# Altium schematic sheet Aux PSU.SchDoc
size A4; SheetNumber: 9; SheetTotal: 12
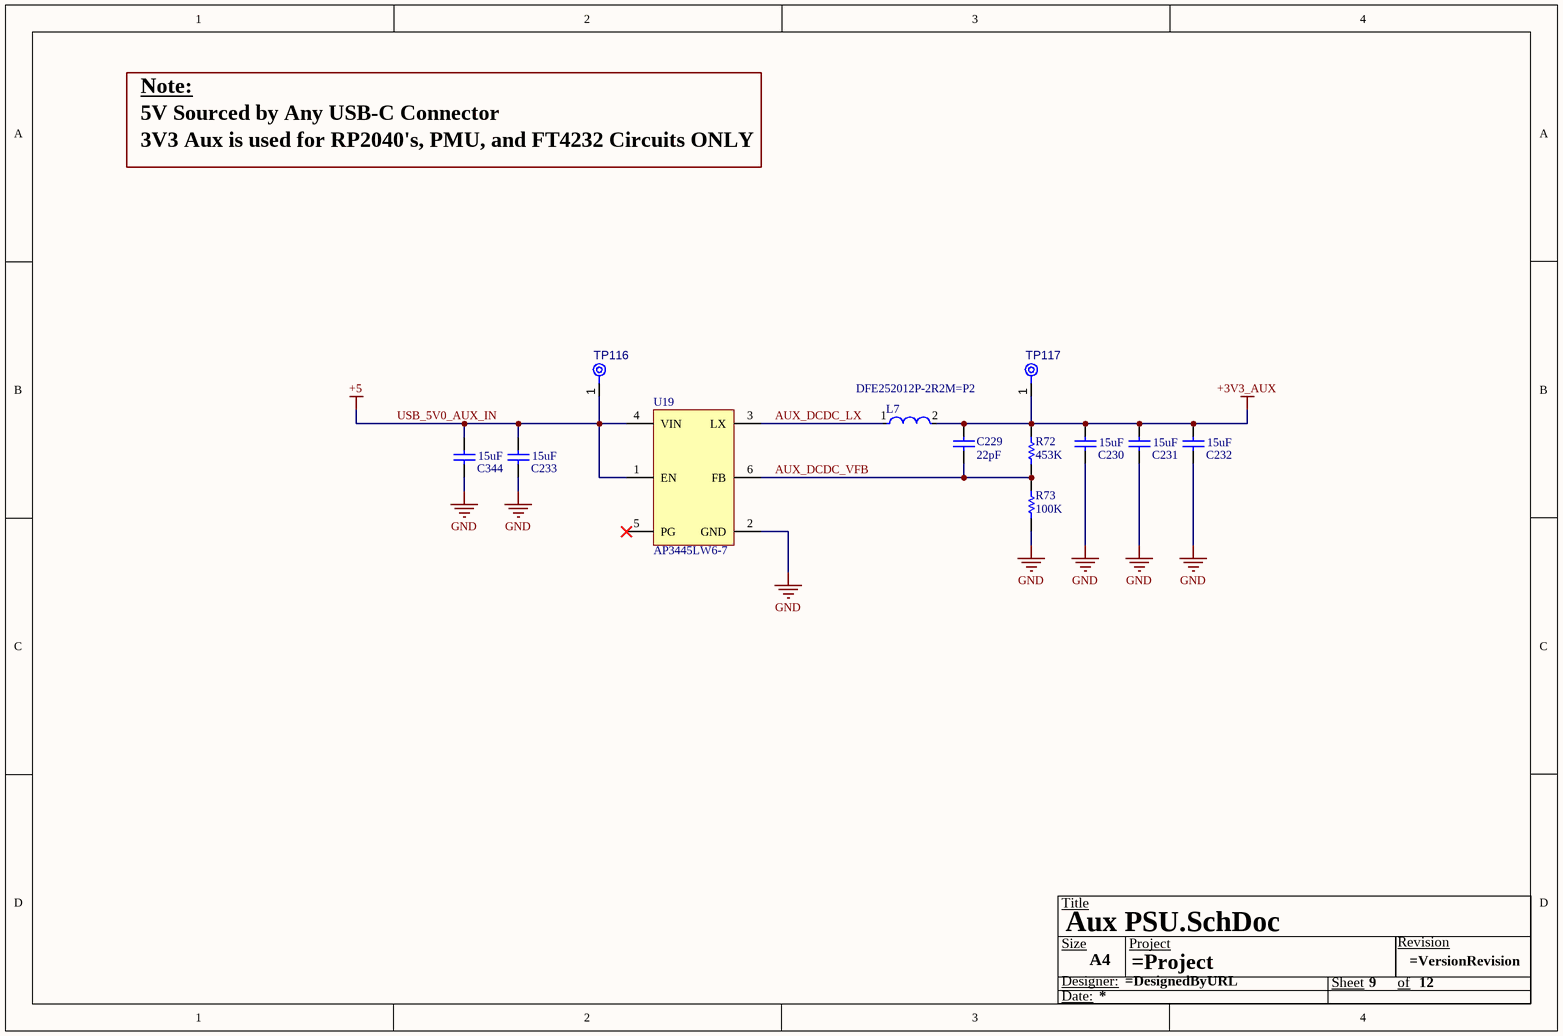
[diagram p0: Aux PSU.SchDoc]

## Parts
*  Size: A4  (hidden comment: Title Block)  (graphical)
C229  22pF  [CAPC1005X55X25ML05T05]
C230  15uF  [CAPC0805(2012)145_L]
C231  15uF  [CAPC0805(2012)145_L]
C232  15uF  [CAPC0805(2012)145_L]
C233  15uF  [CAPC0805(2012)145_L]
C344  15uF  [CAPC0805(2012)145_L]
L7  DFE252012P-2R2M=P2  [FP-DFE252012C-MFG]
R72  453K  [RESC1005X40X25NL05T10]
R73  100K  [RESC1005X40X25NL05T10]
TP116  TPAD6R  [TP06R]  (value not drawn)  (no BOM)
TP117  TPAD6R  [TP06R]  (value not drawn)  (no BOM)
U19  AP3445LW6-7  [SOT95P245X130-6N]

## Nets
+3V3_AUX: C229.2 C230.2 C231.2 C232.2 L7.2 R72.2 TP117.1(TP)
GND: C230.1 C231.1 C232.1 C233.1 C344.1 R73.1 U19.2(GND)
USB_5V0_AUX_IN: C233.2 C344.2 TP116.1(TP) U19.1(EN) U19.4(VIN)  [also labelled +5]
AUX_DCDC_LX: L7.1 U19.3(LX)
AUX_DCDC_VFB: C229.1 R72.1 R73.2 U19.6(FB)

Not connected (* = marked no-connect by the designer): U19 5(PG)*

## Notes on the sheet
- Note:
- 5V Sourced by Any USB-C Connector
- 3V3 Aux is used for RP2040's, PMU, and FT4232 Circuits ONLY
- (in symbol CMP-007-000006-8) Title; Size; Project; Revision; Designer:; Sheet; of; Date:

## Library data of the parts
* = CMP-007-000006-8: Generic Title Block
C229 = CMP-2100-03590-1: Chip Capacitor, 22 pF, +/- 5%, 50 V, -55 to 125 degC, 0402 (1005 Metric), RoHS, Tape and Reel CC0402JRNPO9BN220; Manufacturer: Yageo; Voltage Rating: 50V; Dielectric Material: Ceramic; Temperature Coefficient: 30ppm/degC; Dielectric: C0G; Insulation Resistance: 100GR; Datasheet URL: http://www.yageo.com/NewPortal/yageodocoutput?fileName=/pdf/MLCC/UPY-GP_NP0_16V-to-50V_14.pdf; Depth: 0.5mm; Number of Pins: 2; Height: 0.5mm; Min Operating Temperature: -55degC; REACH SVHC: NoSVHC; Capacitance: 22pF; Max Operating Temperature: 125degC; Voltage Rating (DC): 50V; Composition: Ceramic; Packaging: TapeandReel; Package Quantity: 1; Package Reference: 0402; Length: 1mm; Radiation Hardening: No; Package Description: 2-Pin Surface Mount Device, Body 1 x 0.5 mm; RoHSCompliant: True; Thickness: 0.022inch; Manufacturer URL: http://www.yageo.com/; Mount: SurfaceMount; Case Code (Metric): 1005; Case/Package: 0402; Tolerance: 5%; Termination: SMD/SMT; Width: 0.02inch; Datasheet Version: Rev. 14, 07/2016; Lead Free: LeadFree; Case Code (Imperial): 0402
C230-C233 C344 = CMP-001-00092-1: C Series 0805 15 uF 35 V ±20 % Tolerance X5R SMT Multilayer Ceramic Capacitor C2012X5R1V156M125AC
L7 = CMP-06042-014522-1: Shielded Wirewound Inductor 2.2uH 20% 2200mA 0.084Ω 1008 (2520); Max DC Current: 2.2A; Current Rating: 3A; Core Material: Ferrite; Test Frequency: 1MHz; DC Resistance (DCR): 84mR; Case/Package: 1008; Case Code (Metric): 2520; Resistor Type: Wirewound; Lead Free: Lead Free; Shielding: Shielded; Depth: 2mm; Case Code (Imperial): 1008; Packaging: Tape and Reel; Width: 0.079inch; Min Operating Temperature: -40°C; Height - Seated (Max): 0.039inch; Tolerance: 20%; Max Operating Temperature: 125°C; Mount: Surface Mount; Length: 0.098inch; Inductance: 2.2uH
R72 = CMP-2002-07690-1: RC0402FR-07453KL; Manufacturer: Yageo; Part Number: RC0402FR-07453KL
R73 = CMP-2002-07343-1: RC0402FR-07100KL; Manufacturer: Yageo / Phycomp; Part Number: RC0402FR-07100KL
TP116 TP117 = CMP-00028-00002-1: 0.6mm round; Pins: 1
U19 = CMP-019-00072-1: AP3445 Series 5.5 V 2 A 588 mW Surface Mount Buck Switching Regulator - SOT-23-6